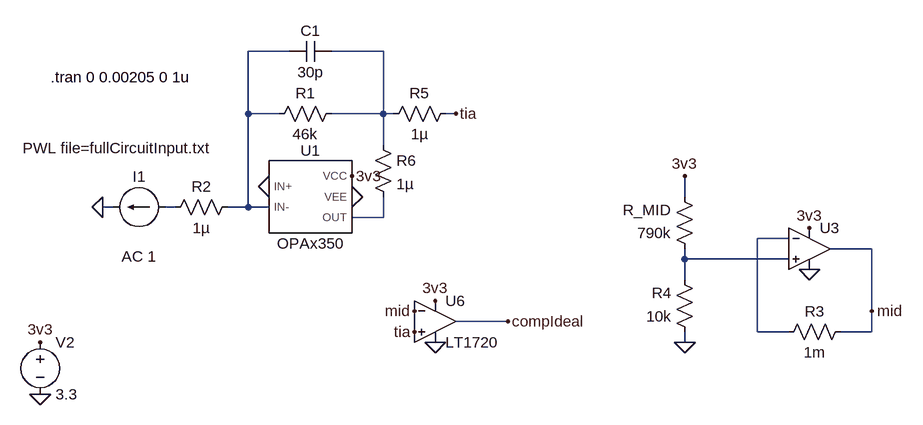
[diagram p0: schematic circuit_LimiarTest.asc]
circuit_LimiarTest.asc, the LTspice schematic file:
Version 4.1
SHEET 1 3920 1676
WIRE 2352 800 2288 800
WIRE 2496 800 2416 800
WIRE 2288 896 2288 800
WIRE 2336 896 2288 896
WIRE 2496 896 2496 800
WIRE 2496 896 2416 896
WIRE 2512 896 2496 896
WIRE 2608 896 2592 896
WIRE 2496 944 2496 896
WIRE 2960 1024 2960 992
WIRE 2080 1040 2064 1040
WIRE 2176 1040 2160 1040
WIRE 2288 1040 2288 896
WIRE 2288 1040 2256 1040
WIRE 2320 1040 2288 1040
WIRE 2496 1056 2496 1024
WIRE 2496 1056 2448 1056
WIRE 3120 1088 3072 1088
WIRE 3248 1104 3184 1104
WIRE 2960 1120 2960 1104
WIRE 3120 1120 2960 1120
WIRE 2960 1152 2960 1120
WIRE 3248 1200 3248 1104
WIRE 2688 1216 2608 1216
WIRE 3072 1232 3072 1088
WIRE 3120 1232 3072 1232
WIRE 3248 1232 3248 1200
WIRE 3248 1232 3200 1232
WIRE 2960 1248 2960 1232
FLAG 2448 992 3v3
FLAG 2448 1024 0
FLAG 2064 1040 0
FLAG 1968 1328 0
FLAG 1968 1248 3v3
FLAG 2320 1008 0
FLAG 2608 896 tia
FLAG 2960 1248 0
FLAG 2960 992 3v3
FLAG 3152 1072 3v3
FLAG 3152 1136 0
FLAG 3248 1200 mid
FLAG 2544 1200 mid
FLAG 2544 1232 tia
FLAG 2576 1184 3v3
FLAG 2576 1248 0
FLAG 2688 1216 compIdeal
SYMBOL res 2432 880 R90
WINDOW 0 0 56 VBottom 2
WINDOW 3 32 56 VTop 2
SYMATTR InstName R1
SYMATTR Value 46k
SYMBOL cap 2416 784 R90
WINDOW 0 0 32 VBottom 2
WINDOW 3 32 32 VTop 2
SYMATTR InstName C1
SYMATTR Value 30p
SYMBOL current 2160 1040 R90
WINDOW 0 -32 40 VBottom 2
WINDOW 3 -107 75 VTop 2
WINDOW 123 60 40 VTop 2
WINDOW 39 0 0 Left 0
SYMATTR InstName I1
SYMATTR Value PWL file=fullCircuitInput.txt
SYMATTR Value2 AC 1
SYMBOL LTSpiceModels\\sbom071e\\OPAx350 2384 1024 R0
SYMATTR InstName U1
SYMBOL voltage 1968 1232 R0
WINDOW 123 0 0 Left 0
WINDOW 39 0 0 Left 0
SYMATTR InstName V2
SYMATTR Value 3.3
SYMBOL Comparators\\LT1720 2576 1152 R0
SYMATTR InstName U6
SYMBOL res 2976 1120 R180
WINDOW 0 36 76 Left 2
WINDOW 3 36 40 Left 2
SYMATTR InstName R_MID
SYMATTR Value 790k
SYMBOL res 2976 1248 R180
WINDOW 0 36 76 Left 2
WINDOW 3 36 40 Left 2
SYMATTR InstName R4
SYMATTR Value 10k
SYMBOL res 3216 1216 R90
WINDOW 0 0 56 VBottom 2
WINDOW 3 32 56 VTop 2
SYMATTR InstName R3
SYMATTR Value 1m
SYMBOL res 2608 880 R90
WINDOW 0 0 56 VBottom 2
WINDOW 3 32 56 VTop 2
SYMATTR InstName R5
SYMATTR Value 1µ
SYMBOL res 2272 1024 R90
WINDOW 0 0 56 VBottom 2
WINDOW 3 32 56 VTop 2
SYMATTR InstName R2
SYMATTR Value 1µ
SYMBOL OpAmps\\UniversalOpAmp2 3152 1104 R0
SYMATTR InstName U3
SYMBOL res 2480 928 R0
SYMATTR InstName R6
SYMATTR Value 1µ
TEXT 1984 840 Left 2 !.tran 0 0.00205 0 1u

The netlist it stands for:
* circuit_LimiarTest.asc
R1 N002 N001 46k
C1 N002 N001 30p
I1 N003 0 PWL file=fullCircuitInput.txt AC 1
X§U1 0 N001 3v3 0 N004 OPAx350  ; pins IN+ IN- VCC VEE OUT
V2 3v3 0 3.3
X§U6 tia mid 3v3 0 compIdeal LT1720  ; pins In+ In- V+ V- OUT
R_MID N006 3v3 790k
R4 0 N006 10k
R3 mid N005 1m
R5 tia N002 1µ
R2 N001 N003 1µ
X§U3 N006 N005 3v3 0 mid level2 Avol=1Meg GBW=10Meg Slew=10Meg Ilimit=25m Rail=0 Vos=0 En=0 Enk=0 In=0 Ink=0 Rin=500Meg  ; pins In+ In- V+ V- OUT
R6 N002 N004 1µ
.tran 0 0.00205 0 1u
.lib C:\Users\jpulu\OneDrive\Área de Trabalho\TCC\LTSpiceModels\sbom071e\OPAx350.LIB
.lib LT1720.sub
.lib UniversalOpAmp2.lib
.backanno
.end